# EAGLE schematic sensor_board_v0.54_trace (EAGLE 7.7.0)
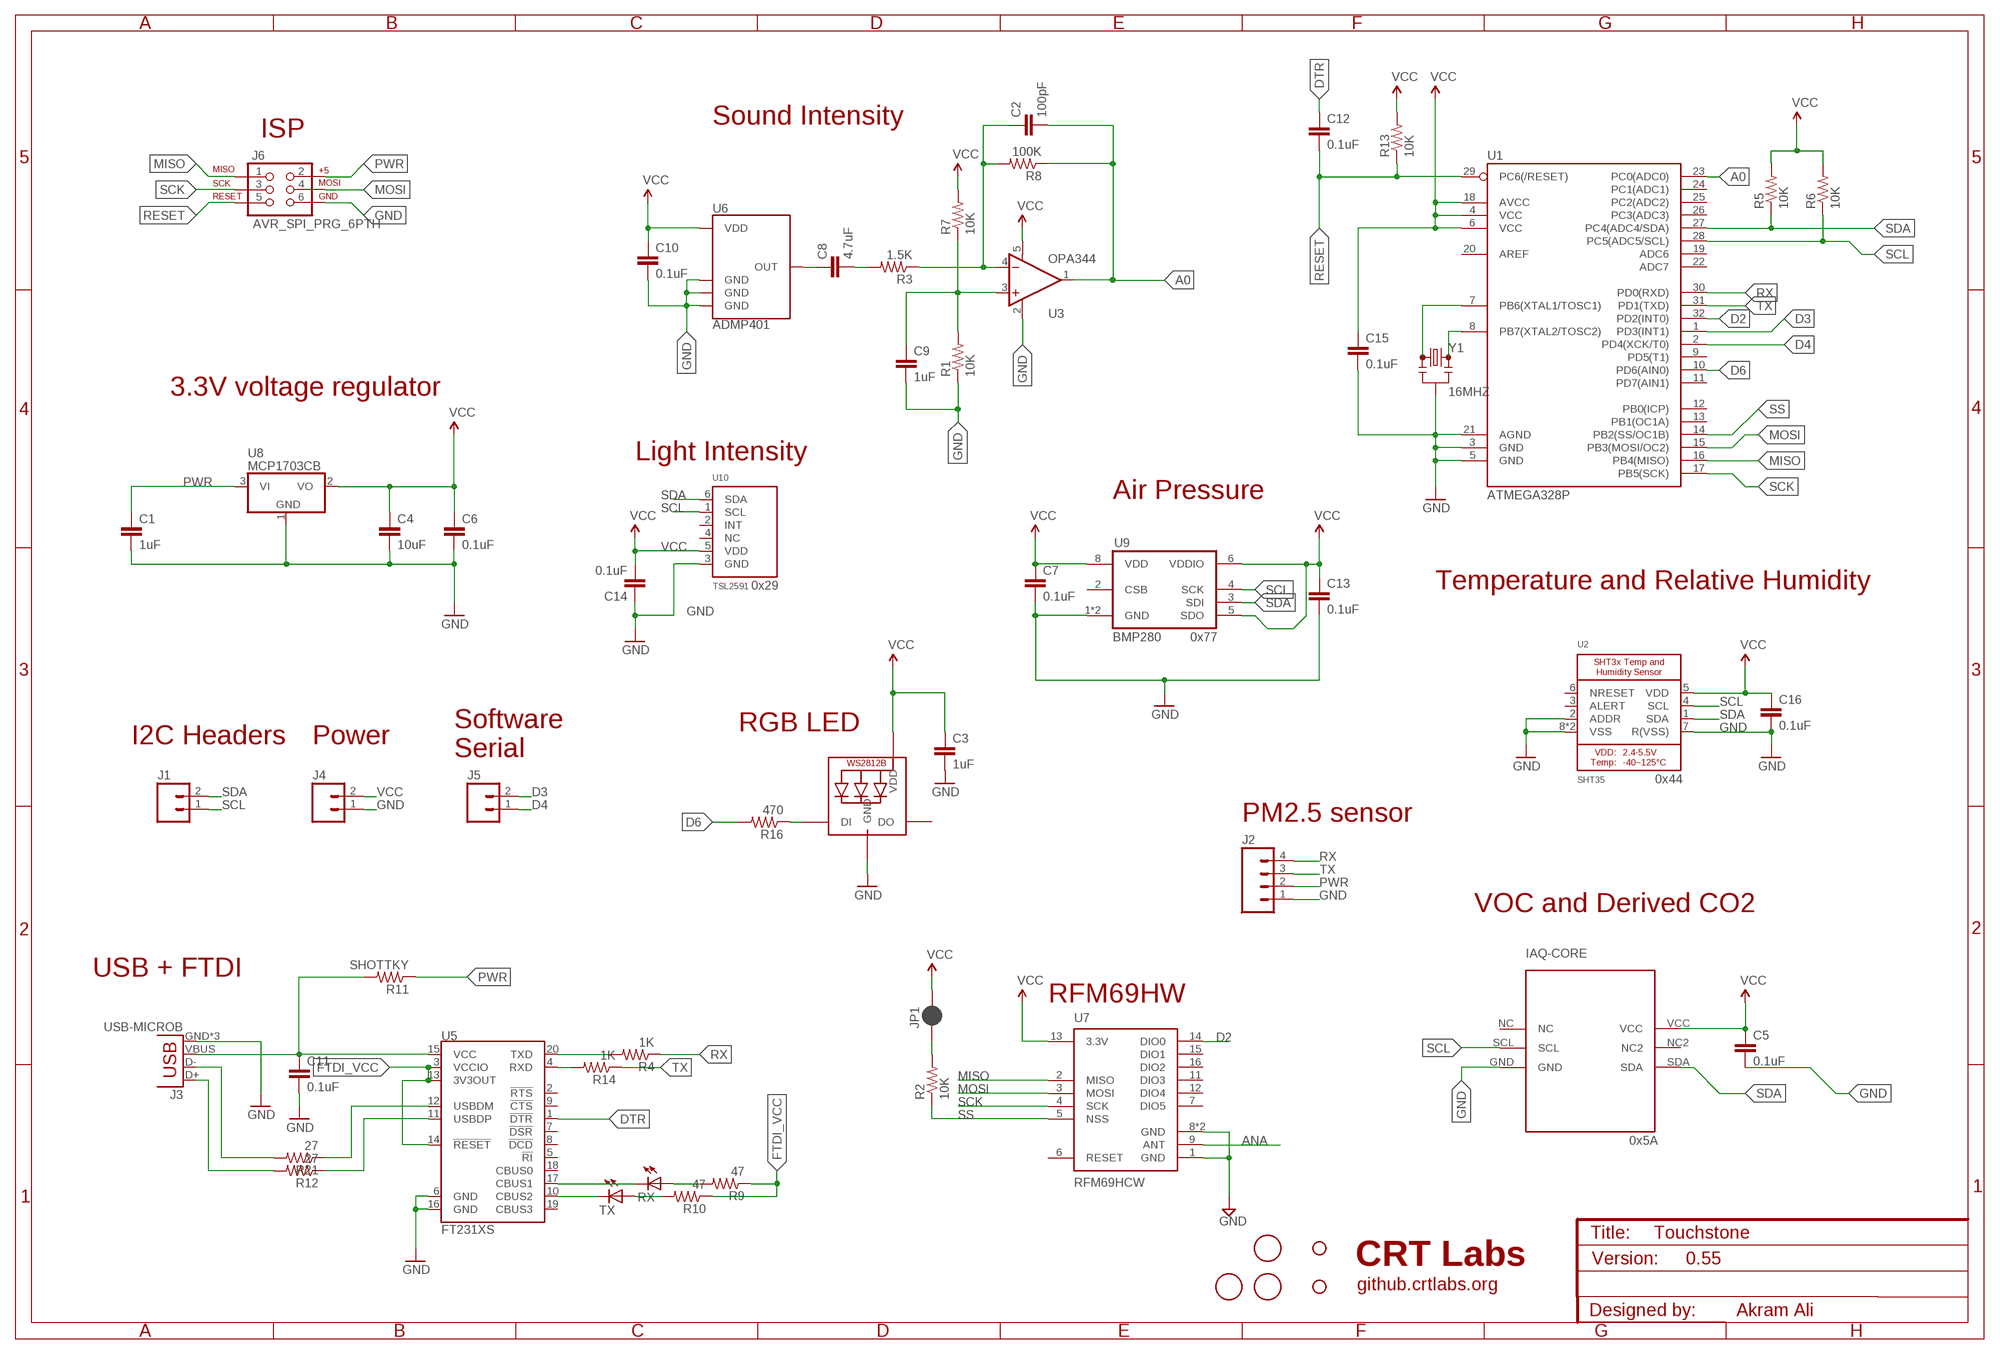
[diagram p0: schematic, sheet 1]

## Parts
C1  1uF  CAP0805  [0805]
C2  100pF  CAP0805  [0805]
C3  1uF  CAP0805  [0805]
C4  10uF  CAP0805  [0805]
C5  0.1uF  CAP0805  [0805]
C6  0.1uF  CAP0805  [0805]
C7  0.1uF  CAP0805  [0805]
C8  4.7uF  CAP0805  [0805]
C9  1uF  CAP0805  [0805]
C10  0.1uF  CAP0805  [0805]
C11  0.1uF  CAP0805  [0805]
C12  0.1uF  CAP0805  [0805]
C13  0.1uF  CAP0805  [0805]
C14  0.1uF  CAP0805  [0805]
C15  0.1uF  CAP0805  [0805]
C16  0.1uF  CAP0805  [0805]
H1  STAND-OFF  [STAND-OFF]
H2  STAND-OFF  [STAND-OFF]
IAQ-CORE  IAQ-CORE  [IAQ-CORE]
J1  M02PTH  [1X02]
J2  M04PTH  [1X04]
J3  USB-MICROB  [USB-MICROB]
J4  M02PTH  [1X02]
J5  M02PTH  [1X02]
J6  AVR_SPI_PRG_6PTH  [2X3]
JP1  JUMPER-PAD-2-NC_BY_PASTEFULL-BOX-SILK  [PAD-JUMPER-2-NC_BY_PASTE_YES_SILK_FULL_BOX]
LED1  WS2812B3535  [LED3535]
R1  10K  RESISTOR0805-RES  [0805]
R2  10K  RESISTOR0805-RES  [0805]
R3  1.5K  RESISTOR0805-RES  [0805]
R4  1K  RESISTOR0805-RES  [0805]
R5  10K  RESISTOR0805-RES  [0805]
R6  10K  RESISTOR0805-RES  [0805]
R7  10K  RESISTOR0805-RES  [0805]
R8  100K  RESISTOR0805-RES  [0805]
R9  47  RESISTOR0805-RES  [0805]
R10  47  RESISTOR0805-RES  [0805]
R11  SHOTTKY  RESISTOR0805-RES  [0805]
R12  27  RESISTOR0805-RES  [0805]
R13  10K  RESISTOR0805-RES  [0805]
R14  1K  RESISTOR0805-RES  [0805]
R16  470  R-US_R0603  [R0603]
R21  27  RESISTOR0805-RES  [0805]
RX  LEDCHIPLED_0805  [CHIPLED_0805]
TX  LEDCHIPLED_0805  [CHIPLED_0805]
U1  ATMEGA328P  ATMEGA328P_TQFP  [TQFP32-08]
U2  SHT35  SHT3X  [SHT3X]
U3  OPA344  [SOT23-5]
U5  FT231XS  [SSOP20_L]
U6  ADMP401  [ADMP401]
U7  RFM69HCW  [RFM69HCW-XXXS2]
U8  MCP1703CB  [SOT23]
U9  BMP280  [BMP280]
U10  TSL2591  LIGHT_TSL2591  [DFN6_TAOS]
U$1  FIDUCIAL  [FIDUCIAL_1MM]
U$2  FIDUCIAL  [FIDUCIAL_1MM]
U$3  FIDUCIAL  [FIDUCIAL_1MM]
Y1  16MHZ  RESONATOR16MHZ  [RESONATOR-SMD]

## Nets
A0: C2.2 R8.1 U1.23(PC0(ADC0)) U3.1(OUT)
ANA: U7.9(ANT)
D2: U1.32(PD2(INT0)) U7.14(DIO0)
D3: J5.2 U1.1(PD3(INT1))
D4: J5.1 U1.2(PD4(XCK/T0))
D6: R16.2 U1.10(PD6(AIN0))
DTR: C12.1 U5.1(!DTR)
FTDI_VCC: R9.1 R10.1 U5.3(VCCIO) U5.13(3V3OUT) U5.14(!RESET)
GND: C1.2 C3.2 C4.2 C5.2 C6.2 C7.2 C9.2 C10.2 C11.2 C13.2 C14.1 C15.2 C16.2 IAQ-CORE.GND J2.1 J3.GND J3.MT1(GND) J3.MT2(GND) J4.1 J6.6 LED1.4(GND) R1.1 U1.3(GND) U1.5(GND) U1.21(AGND) U2.2(ADDR) U2.7(R(VSS)) U2.8(VSS) U2.THERMAL(VSS) U3.2(V-) U5.6(GND) U5.16(GND) U6.2(GND) U6.4(GND) U6.6(GND) U7.1(GND) U7.8(GND) U7.10(GND) U8.1(GND) U9.1(GND) U9.7(GND) U10.3(GND) Y1.2
MISO: J6.1 U1.16(PB4(MISO)) U7.2(MISO)
MOSI: J6.4 U1.15(PB3(MOSI/OC2)) U7.3(MOSI)
N$1: JP1.1 R2.2
N$2: R14.2 U5.4(RXD)
N$3: R4.2 U5.20(TXD)
N$4: U1.8(PB7(XTAL2/TOSC2)) Y1.3
N$5: U1.7(PB6(XTAL1/TOSC1)) Y1.1
N$7: LED1.1(DI) R16.1
N$9: C8.2 R3.2
N$10: C2.1 R3.1 R8.2 U3.4(-IN)
N$11: C9.1 R1.2 R7.1 U3.3(+IN)
N$17: RX.C U5.17(CBUS1)
N$18: TX.C U5.10(CBUS2)
N$25: R21.1 U5.12(USBDM)
N$26: R12.1 U5.11(USBDP)
N$27: R9.2 RX.A
N$29: R10.2 TX.A
N$32: J3.D- R21.2
N$33: J3.D+ R12.2
OUT: C8.1 U6.1(OUT)
PWR: C1.1 J2.2 J6.2 R11.1 U8.3(VI)
RESET: C12.2 J6.5 R13.1 U1.29(PC6(/RESET))
RX: J2.4 R4.1 U1.30(PD0(RXD))
SCK: J6.3 U1.17(PB5(SCK)) U7.4(SCK)
SCL: IAQ-CORE.SCL J1.1 R6.1 U1.28(PC5(ADC5/SCL)) U2.4(SCL) U9.4(SCK) U10.1(SCL)
SDA: IAQ-CORE.SDA J1.2 R5.1 U1.27(PC4(ADC4/SDA)) U2.1(SDA) U9.3(SDI) U10.6(SDA)
SS: R2.1 U1.14(PB2(SS/OC1B)) U7.5(NSS)
TX: J2.3 R14.1 U1.31(PD1(TXD))
VBUS: C11.1 J3.VBUS R11.2 U5.15(VCC)
VCC: C3.1 C4.1 C5.1 C6.1 C7.1 C10.1 C13.1 C14.2 C15.1 C16.1 IAQ-CORE.VCC J4.2 JP1.2 LED1.2(VDD) R5.2 R6.2 R7.2 R13.2 U1.4(VCC) U1.6(VCC) U1.18(AVCC) U2.5(VDD) U3.5(V+) U6.5(VDD) U7.13(3.3V) U8.2(VO) U9.5(SDO) U9.6(VDDIO) U9.8(VDD) U10.5(VDD)
Unconnected: IAQ-CORE.NC IAQ-CORE.NC2 LED1.3(DO) U1.9(PD5(T1)) U1.11(PD7(AIN1)) U1.12(PB0(ICP)) U1.13(PB1(OC1A)) U1.19(ADC6) U1.20(AREF) U1.22(ADC7) U1.24(PC1(ADC1)) U1.25(PC2(ADC2)) U1.26(PC3(ADC3)) U2.3(ALERT) U2.6(NRESET) U5.2(!RTS) U5.5(!RI) U5.7(!DSR) U5.8(!DCD) U5.9(!CTS) U5.18(CBUS0) U5.19(CBUS3) U7.6(RESET) U7.7(DIO5) U7.11(DIO3) U7.12(DIO4) U7.15(DIO1) U7.16(DIO2) U9.2(CSB) U10.2(INT) U10.4(NC)

## Notes on the sheet
- Sound Intensity
- ISP
- 3.3V voltage regulator
- Light Intensity
- Air Pressure
- 0x29 | Temperature and Relative Humidity
- 0x77
- RGB LED
- I2C Headers | Power
- Software
  Serial
- 0x44
- PM2.5 sensor
- VOC and Derived CO2
- USB + FTDI
- RFM69HW
- 0x5A
- Touchstone
- CRT Labs | 0.55
- github.crtlabs.org
- Akram Ali

## Library data of the parts
C1 C3 C9 = SparkFun-Capacitors:CAP: Capacitor Standard 0603 ceramic capacitor, and 0.1" leaded capacitor.; MPN: CC0805ZRY5V8BB105
C2 = SparkFun-Capacitors:CAP: Capacitor Standard 0603 ceramic capacitor, and 0.1" leaded capacitor.; MPN: CC0805JRNPOABN101
C4 = SparkFun-Capacitors:CAP: Capacitor Standard 0603 ceramic capacitor, and 0.1" leaded capacitor.; MPN: CC0805KKX5R6BB106
C5 C7 C12-C16 = SparkFun-Passives:CAP: Capacitor Standard 0603 ceramic capacitor, and 0.1" leaded capacitor.; MPN: CC0805KRX7R9BB104
C6 C10 C11 = SparkFun-Capacitors:CAP: Capacitor Standard 0603 ceramic capacitor, and 0.1" leaded capacitor.; MPN: CC0805KRX7R9BB104
C8 = SparkFun-Capacitors:CAP: Capacitor Standard 0603 ceramic capacitor, and 0.1" leaded capacitor.; MPN: CC0805KKX7R6BB475
H1 H2 = SparkFun-Electromechanical:STAND-OFF: #4 Stand Off This is the mechanical footprint for a #4 phillips button head screw. Use the keepout ring to avoid running the screw head into surrounding components. SKU : PRT-00447
IAQ-CORE = IAQ-CORE:IAQ-CORE; MPN: IAQ-CORE C; OC_NEWARK: 82Y5455
J1 J4 J5 = SparkFun-Connectors:M02: Standard 2-pin 0.1" header. Use with - straight break away headers ( PRT-00116) - right angle break away headers (PRT-00553) - swiss pins (PRT-00743) - machine pins (PRT-00117) - female headers (PRT-00115) Molex polarized connector foot print use with: PRT-08233 with associated crimp pins and housings. 2.54_SCREWTERM for use with PRT-10571. 3.5mm Screw Terminal footprints for PRT-08084 5mm Screw Terminal footprints for use with PRT-08432
J2 = SparkFun-Connectors:M04: Header 4 Standard 4-pin 0.1" header. Use with straight break away headers (SKU : PRT-00116), right angle break away headers (PRT-00553), swiss pins (PRT-00743), machine pins (PRT-00117), and female headers (PRT-00115). Molex polarized connector foot print use with SKU : PRT-08231 with associated crimp pins and housings. 1MM SMD Version SKU: PRT-10208; PROD_ID: CONN-09696
J3 = SparkFun-Connectors:USB: USB Connectors USB-B-PTH is fully proven SKU : PRT-00139/CONN-08278 USB-miniB is fully proven SKU : PRT-00587 USB-A-PCB is untested. USB-A-H is throughly reviewed, but untested. Spark Fun Electronics SKU : PRT-00437 USB-B-SMT is throughly reviewed, but untested. Needs silkscreen touching up. USB-A-S has not been used/tested USB-MB-H has not been used/tested USB-MICROB has been used. CONN-09505; MPN: 47346-0001; PROD_ID: CONN-09505
J6 = SparkFun-Connectors:AVR_SPI_PRG_6: AVR ISP 6 Pin This is the reduced ISP connector for AVR programming. Common on Arduino. This footprint will take up less PCB space and can be used with a 10-pin to 6-pin adapter such as SKU: BOB-08508 **Special note about "TEST_POINT" package. The stop mask is on the top side, so if you want your programming test points to be on the bottom of your board, make sure to place this package on the bottom side of the board. This also ensure that the orientation to program from the bottom side will be correct.
JP1 = SparkFun-Passives:JUMPER-PAD-2-NC_BY_PASTE
LED1 = adafruit:WS2812B; MPN: SK6812 mini
R1 R2 R7 R13 = SparkFun-Passives:RESISTOR: Resistor Basic schematic elements and footprints for 0603, 1206, and PTH resistors.; MPN: RC0805FR-0710KL
R3 = SparkFun-Passives:RESISTOR: Resistor Basic schematic elements and footprints for 0603, 1206, and PTH resistors.; MPN: RC0805FR-071K5L
R4 R14 = SparkFun-Passives:RESISTOR: Resistor Basic schematic elements and footprints for 0603, 1206, and PTH resistors.; MPN: RC0805FR-071KL
R5 R6 = SparkFun-Resistors:RESISTOR: Resistor Basic schematic elements and footprints for 0603, 1206, and PTH resistors.; MPN: RC0805FR-0710KL
R8 = SparkFun-Passives:RESISTOR: Resistor Basic schematic elements and footprints for 0603, 1206, and PTH resistors.; MPN: RC0805FR-07100KL
R9 R10 = SparkFun-Passives:RESISTOR: Resistor Basic schematic elements and footprints for 0603, 1206, and PTH resistors.; MPN: RC0805FR-0747RL
R11 = SparkFun-Passives:RESISTOR: Resistor Basic schematic elements and footprints for 0603, 1206, and PTH resistors.; MPN: SD0805S040S0R5; OC_NEWARK: unknown
R12 R21 = SparkFun-Passives:RESISTOR: Resistor Basic schematic elements and footprints for 0603, 1206, and PTH resistors.; MPN: RC0805FR-0727RL
R16 = adafruit:R-US_: RESISTOR, American symbol; MPN: RC0805FR-07470RL
RX TX = adafruit:LED: LED OSRAM: - CHIPLED LG R971, LG N971, LY N971, LG Q971, LY Q971, LO R971, LY R971 LH N974, LH R974 LS Q976, LO Q976, LY Q976 LO Q996 - Hyper CHIPLED LW Q18S LB Q993, LB Q99A, LB R99A - SideLED LS A670, LO A670, LY A670, LG A670, LP A670 LB A673, LV A673, LT A673, LW A673 LH A674 LY A675 LS A676, LA A676, LO A676, LY A676, LW A676 LS A679, LY A679, LG A679 - Hyper Micro SIDELED® LS Y876, LA Y876, LO Y876, LY Y876 LT Y87S - SmartLED LW L88C, LW L88S LB L89C, LB L89S, LG L890 LS L89K, LO L89K, LY L89K LS L896, LA L896, LO L896, LY L896 - TOPLED LS T670, LO T670, LY T670, LG T670, LP T670 LSG T670, LSP T670, LSY T670, LOP T670, LYG T670 LG T671, LOG T671, LSG T671 LB T673, LV T673, LT T673, LW T673 LH T674 LS T676, LA T676, LO T676, LY T676, LB T676, LH T676, LSB T676, LW T676 LB T67C, LV T67C, LT T67C, LS T67K, LO T67K, LY T67K, LW E67C LS E67B, LA E67B, LO E67B, LY E67B, LB E67C, LV E67C, LT E67C LW T67C LS T679, LY T679, LG T679 LS T770, LO T770, LY T770, LG T770, LP T770 LB T773, LV T773, LT T773, LW T773 LH T774 LS E675, LA E675, LY E675, LS T675 LS T776, LA T776, LO T776, LY T776, LB T776 LHGB T686 LT T68C, LB T68C - Hyper Mini TOPLED® LB M676 - Mini TOPLED Santana® LG M470 LS M47K, LO M47K, LY M47K Source: http://www.osram.convergy.de/; MPN: LG R971-KN-1; OC_NEWARK: unknown
U1 = SparkFun-DigitalIC:ATMEGA328P_TQFP; MPN: ATMEGA328PB-AU; OC_NEWARK: 58Y6083; PROD_ID: IC-09069; VALUE: ATMEGA328P_TQFP
U2 = Adafruit SHT31:SHT3X: SHT3x - Digital Temperature and Humidity Sensor Supply Voltage: 2.4-5.5V Humidity Accuracy: SHT30 = +/-3%RH, SHT31 = +/-2%RH Temperature Sensor: -40~125°C (+/-0.3°C from 10-55C); MPN: SHT35-DIS-B
U3 = SparkFun-AnalogIC:OPA344: Single gate rail-to-rail output op-amp. Inputs extend 300mV past rails.; MPN: OPA344NA/3K; PROD_ID: IC-08251
U5 = SparkFun-DigitalIC:FT231X: FTDI FT231X Full Speed USB to Full-handshake UART This USB2.0 Full Speed IC offers a compact bridge to full handshake UART interfaces. The device is a UART, capable of operating up to 3MBaud, with low power consumption (8mA). The FT231X includes the complete FT-X series feature set and enables USB to be added into a system design quickly and easily over a UART interface.; MPN: FT231XQ-R; PROD_ID: IC-11524
U6 = SparkFun-Sensors:ADMP401: Omnidirection bottom-port MEMS microphone; MPN: INMP401ACEZ-R7
U7 = SparkFun-RF:RFM69H; MPN: RFM69HW; PROD_ID: IC-11997, IC-12053
U8 = linear:MCP1703: 250 mA, 16V, Low Quiescent Current LDO Regulator Source: http://ww1.microchip.com/downloads/en/DeviceDoc/22049b.pdf; MPN: MCP1703T-2502E/CB; OC_NEWARK: 18T9177
U9 = bosch-bmp280:BMP280: The BMP280 is an absolute barometric pressure sensor especially designed for mobile applications. The sensor module is housed in an extremely compact 8-pin metal-lid LGA package with a footprint of only 2.0 × 2.5 mm2 and 0.95 mm package height. Its small dimensions and its low power consumption of 2.7 μA @1Hz allow the implementation in battery driven devices such as mobile phones, GPS modules or watches. The library has been designed by Richard Magdycz <https://www.facebook.com/groups/eaglecadsoftUK>; MPN: BMP280
U10 = TSL2591:LIGHT_TSL2591: TSL2591 Light-To-Digital Sensor; MPN: TSL25911FN
U$1-U$3 = adafruit:FIDUCIAL: For use by pick and place machines to calibrate the vision/machine, 1mm By microbuilder.eu
Y1 = SparkFun-FreqCtrl:RESONATOR: Resonator Small SMD resonator. Used, eg, on the Arduino Pro/ Pro Mini boards. 8MHz- XTAL-08895 16MHz- XTAL-08900; MPN: CSTCE16M0V53-R0; OC_NEWARK: unknown; PROD_ID: XTAL-08900

## Net classes
1 power: width 0.381 mm, clearance 0.254 mm